# EAGLE schematic chrl (EAGLE 6.4)
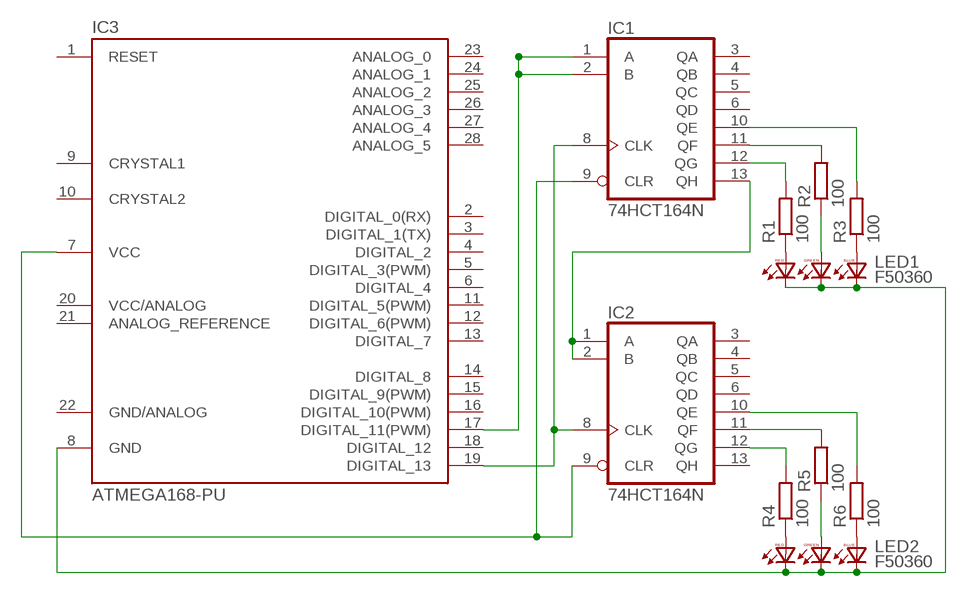
[diagram p0: schematic, sheet 1]

## Parts
IC1  74HCT164N  [DIL14]
IC2  74HCT164N  [DIL14]
IC3  ATMEGA168-PU  [DIL28-3]
LED1  F50360  [F50360]
LED2  F50360  [F50360]
R1  100  R-EU_0204/7  [0204/7]
R2  100  R-EU_0204/7  [0204/7]
R3  100  R-EU_0204/7  [0204/7]
R4  100  R-EU_0204/7  [0204/7]
R5  100  R-EU_0204/7  [0204/7]
R6  100  R-EU_0204/7  [0204/7]

## Nets
N$1: IC1.1(A) IC1.2(B) IC3.17(DIGITAL_11(PWM))
N$2: IC1.13(QH) IC2.1(A) IC2.2(B)
N$3: LED1.RA R1.1
N$4: LED1.BA R3.1
N$5: LED1.GA R2.1
N$6: IC1.12(QG) R1.2
N$7: IC1.11(QF) R2.2
N$8: IC1.10(QE) R3.2
N$9: LED2.RA R4.1
N$10: LED2.BA R6.1
N$11: LED2.GA R5.1
N$12: IC2.12(QG) R4.2
N$13: IC2.11(QF) R5.2
N$14: IC2.10(QE) R6.2
N$15: IC3.8(GND) LED1.BC LED1.GC LED1.RC LED2.BC LED2.GC LED2.RC
N$16: IC1.9(CLR) IC2.9(CLR) IC3.7(VCC)
N$17: IC1.8(CLK) IC2.8(CLK) IC3.19(DIGITAL_13)
Unconnected: IC1.3(QA) IC1.4(QB) IC1.5(QC) IC1.6(QD) IC2.3(QA) IC2.4(QB) IC2.5(QC) IC2.6(QD) IC2.13(QH) IC3.1(RESET) IC3.2(DIGITAL_0(RX)) IC3.3(DIGITAL_1(TX)) IC3.4(DIGITAL_2) IC3.5(DIGITAL_3(PWM)) IC3.6(DIGITAL_4) IC3.9(CRYSTAL1) IC3.10(CRYSTAL2) IC3.11(DIGITAL_5(PWM)) IC3.12(DIGITAL_6(PWM)) IC3.13(DIGITAL_7) IC3.14(DIGITAL_8) IC3.15(DIGITAL_9(PWM)) IC3.16(DIGITAL_10(PWM)) IC3.18(DIGITAL_12) IC3.20(VCC/ANALOG) IC3.21(ANALOG_REFERENCE) IC3.23(ANALOG_0) IC3.24(ANALOG_1) IC3.25(ANALOG_2) IC3.26(ANALOG_3) IC3.27(ANALOG_4) IC3.28(ANALOG_5)

## Power pins joined to a net without a drawn wire
GND: IC1.7(GND) IC2.7(GND)
GND/ANALOG: IC3.22(GND/ANALOG)
VCC: IC1.14(VCC) IC2.14(VCC)

## Library data of the parts
IC1 IC2 = 74xx-eu:74*164: 8-bit parallel out SHIFT REGISTER
IC3 = Arduino-AVR:ATMEGA168-PU
LED1 LED2 = led:F50360: Full color Z-Power LED RGB P5-II Series Source: http://www.seoulsemicon.co.kr .. F50360.pdf
R1-R6 = resistor:R-EU_: RESISTOR, European symbol